# EAGLE schematic convertisseur3V3 (EAGLE 7.6.0)
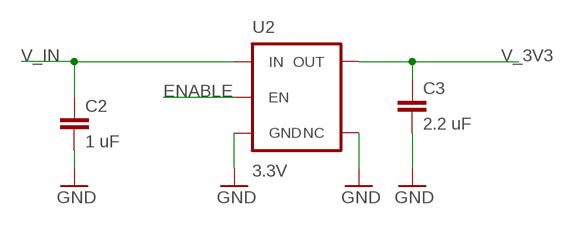
[diagram p0: schematic, sheet 1]

## Parts
C2  1 uF  CAP1206  [1206]
C3  2.2 uF  CAP1206  [1206]
U2  3.3V  V_REG_AP2112K-3.3V  [SOT23-5]

## Nets
ENABLE: U2.3(EN)
GND: C2.2 C3.2 U2.2(GND) U2.4(NC)
V_3V3: C3.1 U2.5(OUT)
V_IN [SUPPLY]: C2.1 U2.1(IN)

## Library data of the parts
C2 C3 = SparkFun-Capacitors:CAP: Capacitor Standard 0603 ceramic capacitor, and 0.1" leaded capacitor.
U2 = SparkFun-PowerIC:V_REG_AP2112: AP2112 - 600mA CMOS LDO Regulator w/ Enable The AP2112 is CMOS process low dropout linear regulator with enable function, the regulator delivers a guaranteed 600mA (min.) continuous load current. Features Output Voltage Accuracy: ±1.5% Output Current: 600mA (Min.) Foldback Short Current Protection: 50mA Enable Function to Turn ON/OFF VOUT Low Dropout Voltage (3.3V): 250mV (Typ.) @IOUT=600mA Excellent Load Regulation: 0.2%/A (Typ.) Excellent Line Regulation: 0.02%/V (Typ.) Low Quiescent Current: 55μA (Typ.) Low Standby Current: 0.01μA (Typ.) Low Output Noise: 50μVRMS PSRR: 100Hz -65dB, 1kHz -65dB OTSD Protection Stable with 1.0μF Flexible Cap: Ceramic, Tantalum and Aluminum Electrolytic Operation Temperature Range: -40°C to 85°C ESD: MM 400V, HBM 4000V; PROD_ID: VREG-12457

## Net classes
1 SUPPLY: width 0.5 mm, drill 0.2 mm, clearance 0.5 mm